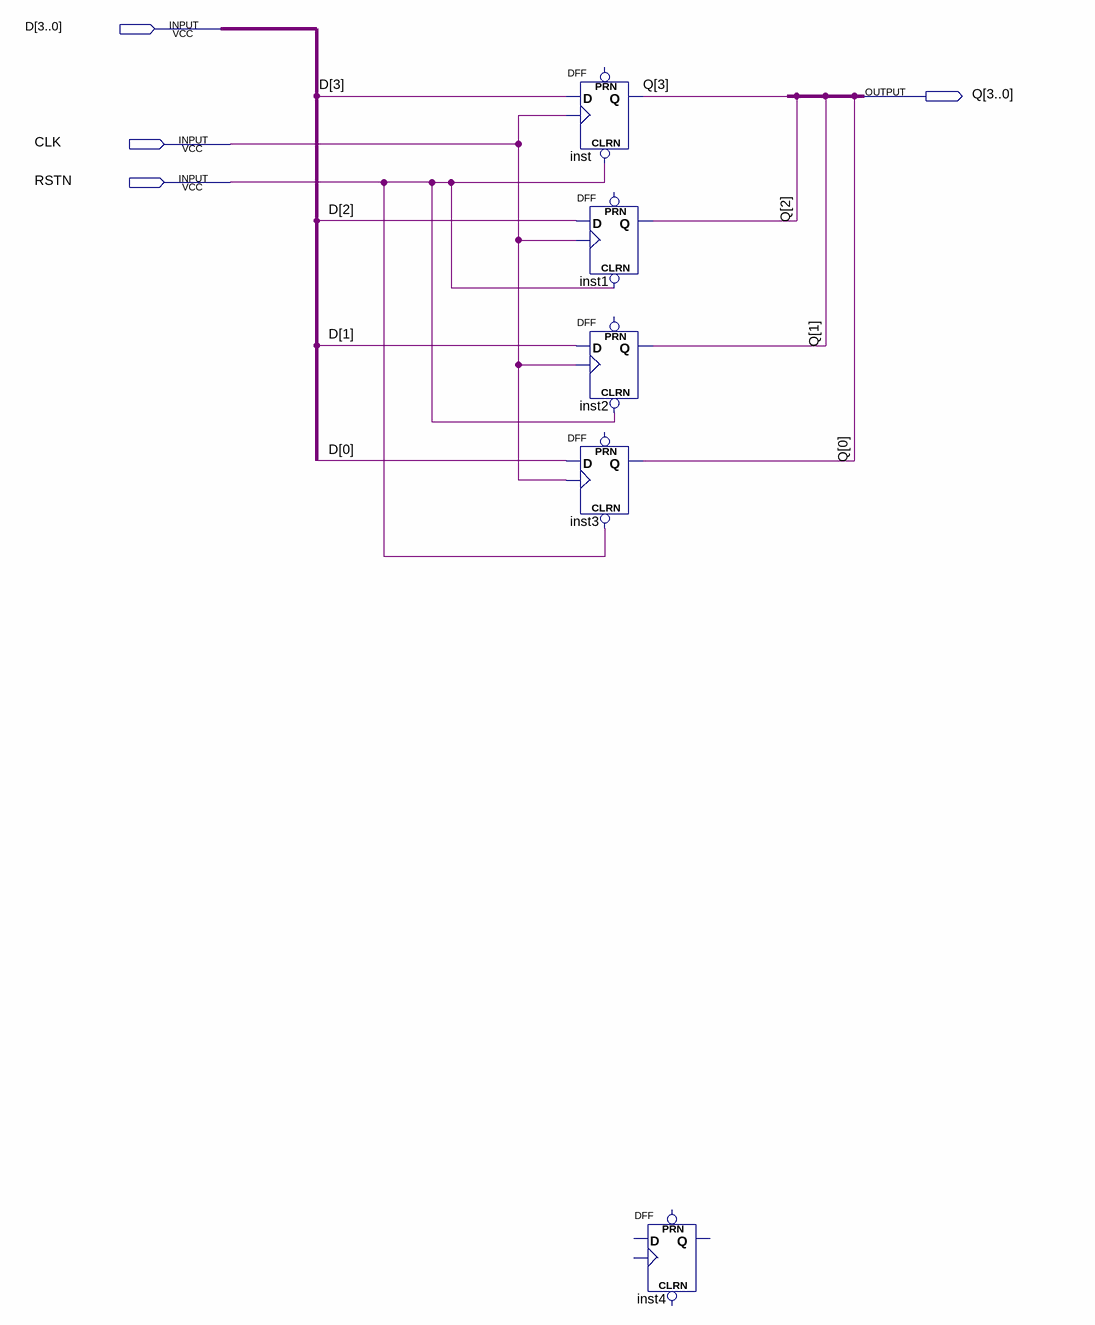
[diagram p0: schematic sheet]
// Quartus schematic reg4new.bdf as structural Verilog: 5 symbols, 4 pins
module reg4new (
  input  [3:0] D,
  input  CLK,
  input  RSTN,
  output [3:0] Q
);

  DFF inst (.CLRN(RSTN), .CLK(CLK), .D(D[3]), .Q(Q[3]));  // open: PRN
  DFF inst1 (.CLRN(RSTN), .CLK(CLK), .D(D[2]), .Q(Q[2]));  // open: PRN
  DFF inst2 (.CLRN(RSTN), .CLK(CLK), .D(D[1]), .Q(Q[1]));  // open: PRN
  DFF inst3 (.CLRN(RSTN), .CLK(CLK), .D(D[0]), .Q(Q[0]));  // open: PRN
  DFF inst4 ();  // open: CLRN, CLK, D, PRN, Q
endmodule
